# Altium schematic sheet BufAmp.schdoc: Analog Amplifier
size A4; Organization: Altium Limited; Address1: L3, 12a Rodborough Rd; Address2: Frenchs Forest; Address3: NSW; Address4: Australia 2086; DocumentNumber: 1; SheetNumber: 1; SheetTotal: 1
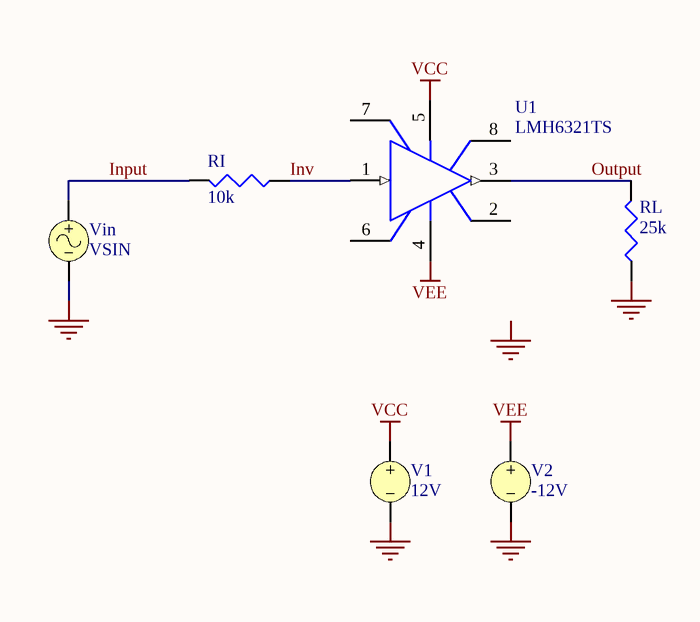
[diagram p0: BufAmp.schdoc]

## Parts
RI  10k
RL  25k
U1  LMH6321TS  [TS7B_N]
V1  12V
V2  -12V
Vin  VSIN

## Nets
GND: RL.2(BOT) V1.2 V2.2 Vin.2
VCC: U1.5(V+) V1.1
VEE: U1.4(V-) V2.1
Input: RI.1(TOP) Vin.1
Inv: RI.2(BOT) U1.1(IN)
Output: RL.1(TOP) U1.3(OUT)

Not connected (* = marked no-connect by the designer): U1 2(GND) 6(EF) 7(CL) 8(DAP)

## Notes on the sheet
- Labels drawn without touching a wire or pin: GND
- Title
- Size:
- Date:
- A4
- Number:
- Time:
- Revision:
- Sheet
- of
- File:

## Library data of the parts
RI RL = RES: Resistor
  RI: Value: 10k
  RL: Value: 25k
U1 = LMH6321TS: 300 mA High Speed Buffer with Adjustable Current Limit; Manufacturer: National Semiconductor; CompType: Amplifiers; PackageTopMarking: NSUZXYTTE#*LMH6321TS; DeviceFunction: Buffer Amplifier; Published: 4-Dec-2008; DatasheetVersion: Apr-2007; PackageVersion: revE, Jul-2003; PackageReference: TS7B; Publisher: Altium Limited; PackageDescription: TO-263, Molded, .400 x .390 x .180in Body, 7 Lead, .050in Pitch, Surface Mount; PartNumber: LMH6321TS; RoHS: Y; PinCount: 7; DigiKeyPartNumber: LMH6321TS-ND; Code_JEDEC: MO-169-AC; ComponentLink1Description: LMH6321 Datasheet; ComponentLink1URL: http://www.national.com/ds/LM/LMH6321.pdf; ComponentLink2Description: LMH6321 Web Page; ComponentLink2URL: http://www.national.com/pf/LM/LMH6321.html; ComponentLink3Description: TS7B Package Page; ComponentLink3URL: http://www.national.com/packaging/folders/ts7b.html
V1 V2 = VSRC: Voltage Source
  V1: Value: 12V
  V2: Value: -12V
Vin = VSIN: Sinusoidal Voltage Source